# EAGLE design sesame-02 (EAGLE 5.11)
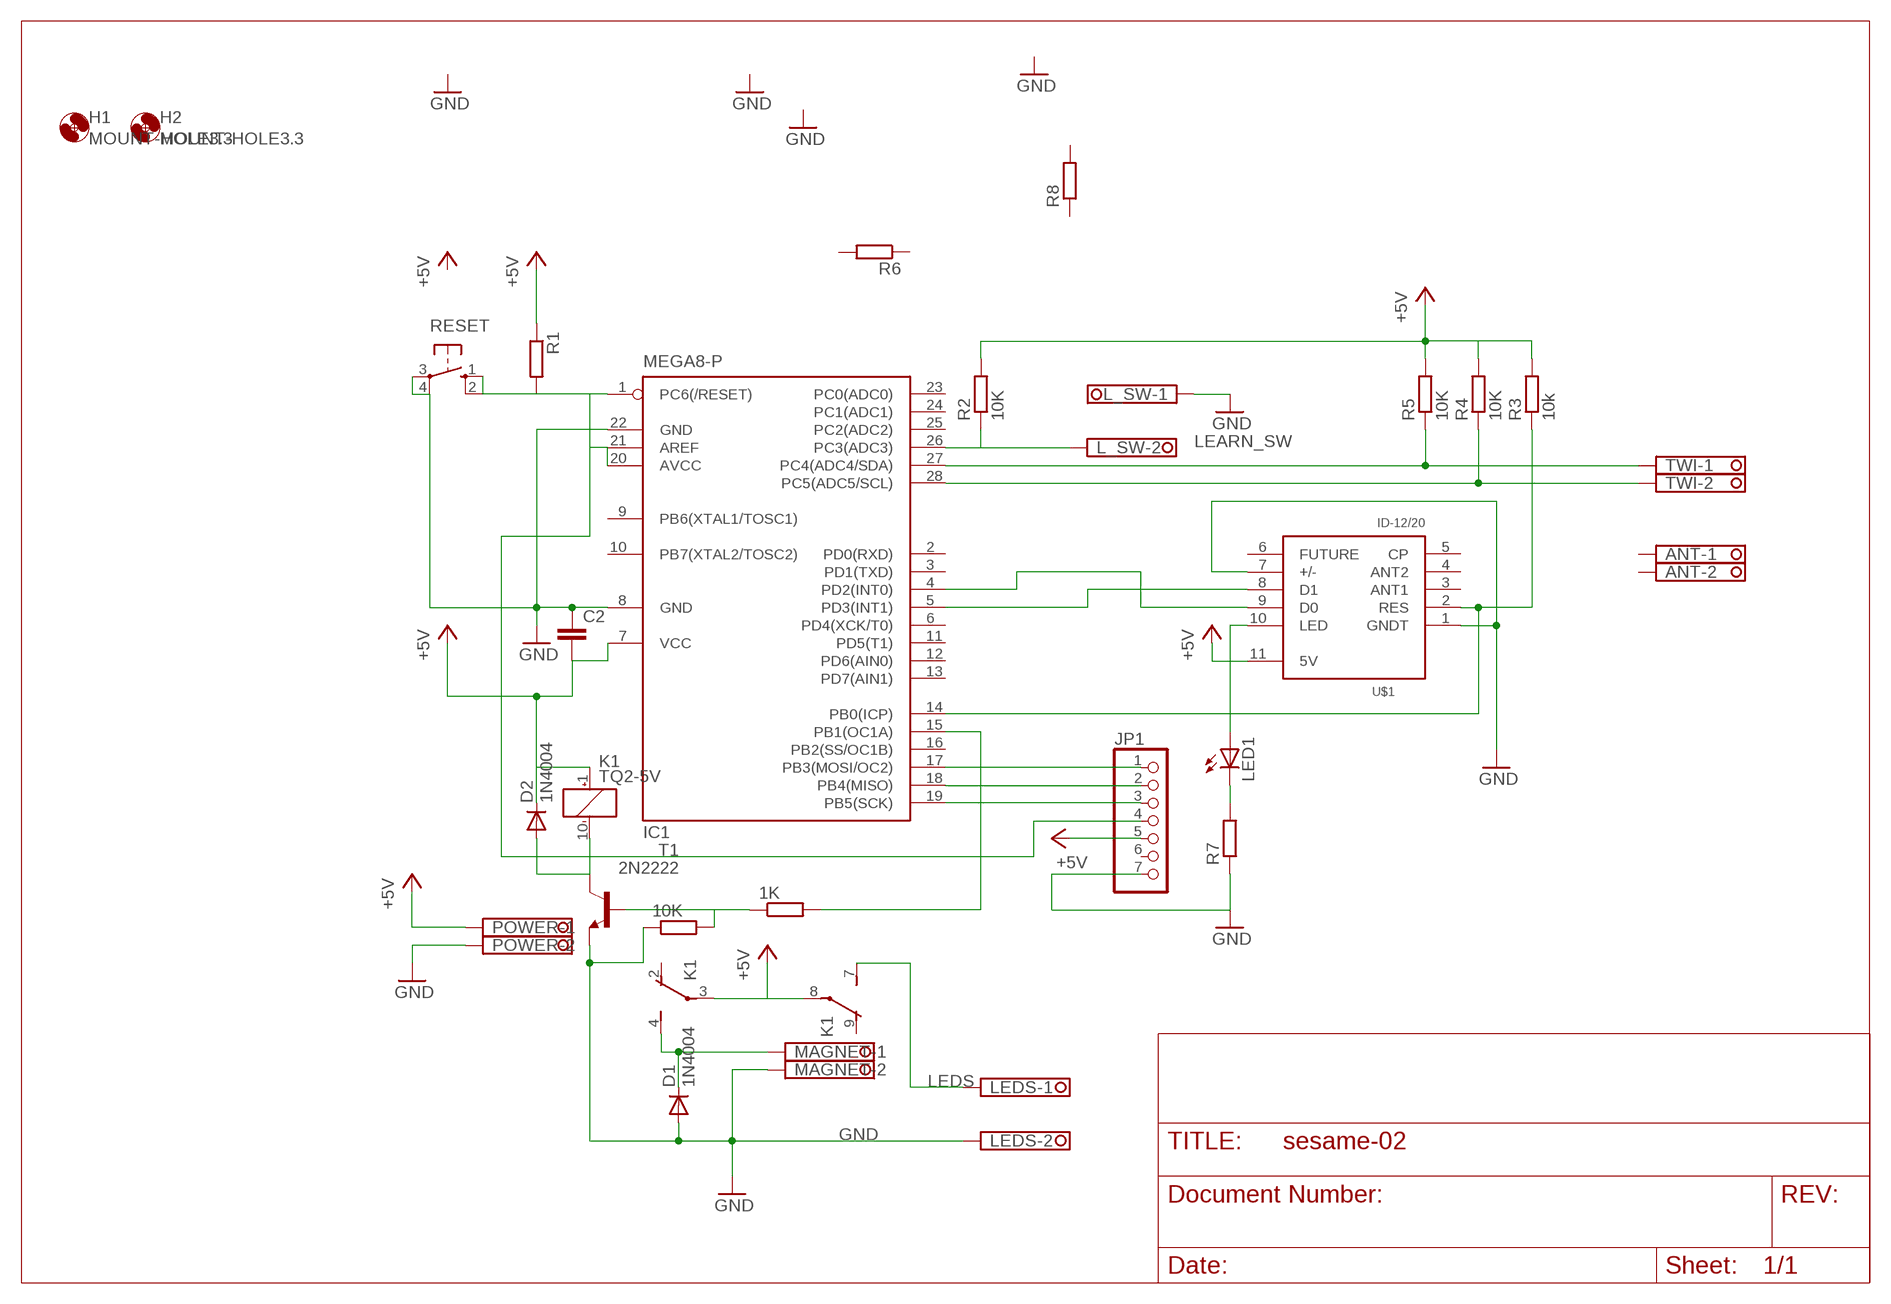
[diagram p0: schematic, sheet 1]

## Parts
1K  R-EU_0204/7  [0204/7]
10K  R-EU_0204/7  [0204/7]
ANT  1751248  [1751248]
C2  C-EU025-030X050  [C025-030X050]
D1  1N4004  [DO41-10]
D2  1N4004  [DO41-10]
H1  MOUNT-HOLE3.3  [3,3]
H2  MOUNT-HOLE3.3  [3,3]
IC1  MEGA8-P  [DIL28-3]
JP1  PINHD-1X7  [1X07]
K1  TQ2-5V  [TQ2]
L_SW  1751248  [1751248]
LED1  LED3MM  [LED3MM]
LEDS  1751248  [1751248]
MAGNET  1751248  [1751248]
POWER  1751248  [1751248]
R1  R-EU_0204/7  [0204/7]
R2  10K  R-EU_0204/5  [0204/5]
R3  10k  R-EU_0204/7  [0204/7]
R4  10K  R-EU_0204/7  [0204/7]
R5  10K  R-EU_0204/7  [0204/7]
R6  R-EU_0204/7  [0204/7]
R7  R-EU_0204/7  [0204/7]
R8  R-EU_0204/7  [0204/7]
RESET  10-XX  [B3F-10XX]
T1  2N2222  [TO18]
TWI  1751248  [1751248]
U$1  ID-12/20  [ID-12]

## Nets
+5V: C2.2 D2.C IC1.7(VCC) JP1.5 K1.3(1:P) K1.8(2:P) POWER.1 R1.1 R2.2 R3.2 R4.2 R5.2 U$1.11(5V)
GND: 10K.1 C2.1 D1.A IC1.8(GND) IC1.22(GND) JP1.7 L_SW.1 LEDS.2 MAGNET.2 POWER.2 R7.1 RESET.3(P) RESET.4(P1) T1.1(E) U$1.1(GNDT) U$1.7(+/-)
LEARN_SW: IC1.26(PC3(ADC3)) L_SW.2 R2.1
LEDS: K1.7(2:S) LEDS.1
N$1: IC1.5(PD3(INT1)) U$1.8(D1)
N$2: 1K.2 IC1.15(PB1(OC1A))
N$3: IC1.28(PC5(ADC5/SCL)) R4.1 TWI.2
N$4: IC1.27(PC4(ADC4/SDA)) R5.1 TWI.1
N$5: IC1.4(PD2(INT0)) U$1.9(D0)
N$7: IC1.19(PB5(SCK)) JP1.3
N$8: IC1.18(PB4(MISO)) JP1.2
N$9: IC1.17(PB3(MOSI/OC2)) JP1.1
N$10: D1.C K1.4(1:S) MAGNET.1
N$11: IC1.14(PB0(ICP)) R3.1 U$1.2(RES)
N$13: 1K.1 10K.2 T1.2(B)
N$18: IC1.1(PC6(/RESET)) IC1.20(AVCC) IC1.21(AREF) JP1.4 R1.2 RESET.1(S) RESET.2(S1)
N$21: LED1.A U$1.10(LED)
N$22: LED1.K(C) R7.2
N$23: D2.A K1.10(_:-) T1.3(C)
Unconnected: ANT.1 ANT.2 IC1.2(PD0(RXD)) IC1.3(PD1(TXD)) IC1.6(PD4(XCK/T0)) IC1.9(PB6(XTAL1/TOSC1)) IC1.10(PB7(XTAL2/TOSC2)) IC1.11(PD5(T1)) IC1.12(PD6(AIN0)) IC1.13(PD7(AIN1)) IC1.16(PB2(SS/OC1B)) IC1.23(PC0(ADC0)) IC1.24(PC1(ADC1)) IC1.25(PC2(ADC2)) JP1.6 K1.1(_:+) K1.2(1:O) K1.9(2:O) R6.1 R6.2 R8.1 R8.2 U$1.3(ANT1) U$1.4(ANT2) U$1.5(CP) U$1.6(FUTURE)

## Library data of the parts
1K 10K R1-R8 = rcl:R-EU_: RESISTOR, European symbol
ANT L_SW LEDS MAGNET POWER TWI = con-phoenix-350:1751248: MKDS 1/ 2-3,5 Printklemme Nennstrom: 10 A Bemessungsspannung: 160 V Raster: 3,5 mm Polzahl: 2 Montageart: Löten Anschlussart: Schraubanschluss Anschlussrichtung vom Leiter zur Platine: 0° Source: http://eshop.phoenixcontact.com .. 1751248.pdf
C2 = rcl:C-EU: CAPACITOR, European symbol
D1 D2 = diode:1N4004: DIODE general purpose rectifier, 1 A
H1 H2 = holes:MOUNT-HOLE: MOUNTING HOLE with drill center marker
IC1 = atmel:MEGA8-P: MICROCONTROLLER 8 Kbytes FLASH, 1 kbytes SRAM, 512 bytes EEPROM, USART, 4-channel 10 bit ADC, 2-channel 8 bit ADC Pin compatible with Atmega48, ATMega88, ATMega168 Source: avr.lbr
JP1 = pinhead:PINHD-1X7: PIN HEADER
K1 = relay:TQ2?*: LOW PROFILE 2 FORM C RELAY NAiS Source: http://www.mew-europe.com/.. en_ds_61020_0001.pdf Source: http://www.mew-europe.com/.. en_ds_61020_0004.pdf
LED1 = led:LED: LED OSRAM: - CHIPLED LG R971, LG N971, LY N971, LG Q971, LY Q971, LO R971, LY R971 LH N974, LH R974 LS Q976, LO Q976, LY Q976 LO Q996 - Hyper CHIPLED LW Q18S LB Q993, LB Q99A, LB R99A - SideLED LS A670, LO A670, LY A670, LG A670, LP A670 LB A673, LV A673, LT A673, LW A673 LH A674 LY A675 LS A676, LA A676, LO A676, LY A676, LW A676 LS A679, LY A679, LG A679 - Hyper Micro SIDELED® LS Y876, LA Y876, LO Y876, LY Y876 LT Y87S - SmartLED LW L88C, LW L88S LB L89C, LB L89S, LG L890 LS L89K, LO L89K, LY L89K LS L896, LA L896, LO L896, LY L896 - TOPLED LS T670, LO T670, LY T670, LG T670, LP T670 LSG T670, LSP T670, LSY T670, LOP T670, LYG T670 LG T671, LOG T671, LSG T671 LB T673, LV T673, LT T673, LW T673 LH T674 LS T676, LA T676, LO T676, LY T676, LB T676, LH T676, LSB T676, LW T676 LB T67C, LV T67C, LT T67C, LS T67K, LO T67K, LY T67K, LW E67C LS E67B, LA E67B, LO E67B, LY E67B, LB E67C, LV E67C, LT E67C LW T67C LS T679, LY T679, LG T679 LS T770, LO T770, LY T770, LG T770, LP T770 LB T773, LV T773, LT T773, LW T773 LH T774 LS E675, LA E675, LY E675, LS T675 LS T776, LA T776, LO T776, LY T776, LB T776 LHGB T686 LT T68C, LB T68C - Hyper Mini TOPLED® LB M676 - Mini TOPLED Santana® LG M470 LS M47K, LO M47K, LY M47K Source: http://www.osram.convergy.de LUXEON: - LUMILED® LXK2-PW12-R00, LXK2-PW12-S00, LXK2-PW14-U00, LXK2-PW14-V00 LXK2-PM12-R00, LXK2-PM12-S00, LXK2-PM14-U00 LXK2-PE12-Q00, LXK2-PE12-R00, LXK2-PE12-S00, LXK2-PE14-T00, LXK2-PE14-U00 LXK2-PB12-K00, LXK2-PB12-L00, LXK2-PB12-M00, LXK2-PB14-N00, LXK2-PB14-P00, LXK2-PB14-Q00 LXK2-PR12-L00, LXK2-PR12-M00, LXK2-PR14-Q00, LXK2-PR14-R00 LXK2-PD12-Q00, LXK2-PD12-R00, LXK2-PD12-S00 LXK2-PH12-R00, LXK2-PH12-S00 LXK2-PL12-P00, LXK2-PL12-Q00, LXK2-PL12-R00 Source: www.luxeon.com KINGBRIGHT: KA-3528ASYC Source: www.kingbright.com
RESET = switch-omron:10-XX: OMRON SWITCH
T1 = transistor:2N2222: NPN TRANSISTOR
U$1 = SparkFun:ID-12/20: ID2, ID12, and ID20 Package

## Board
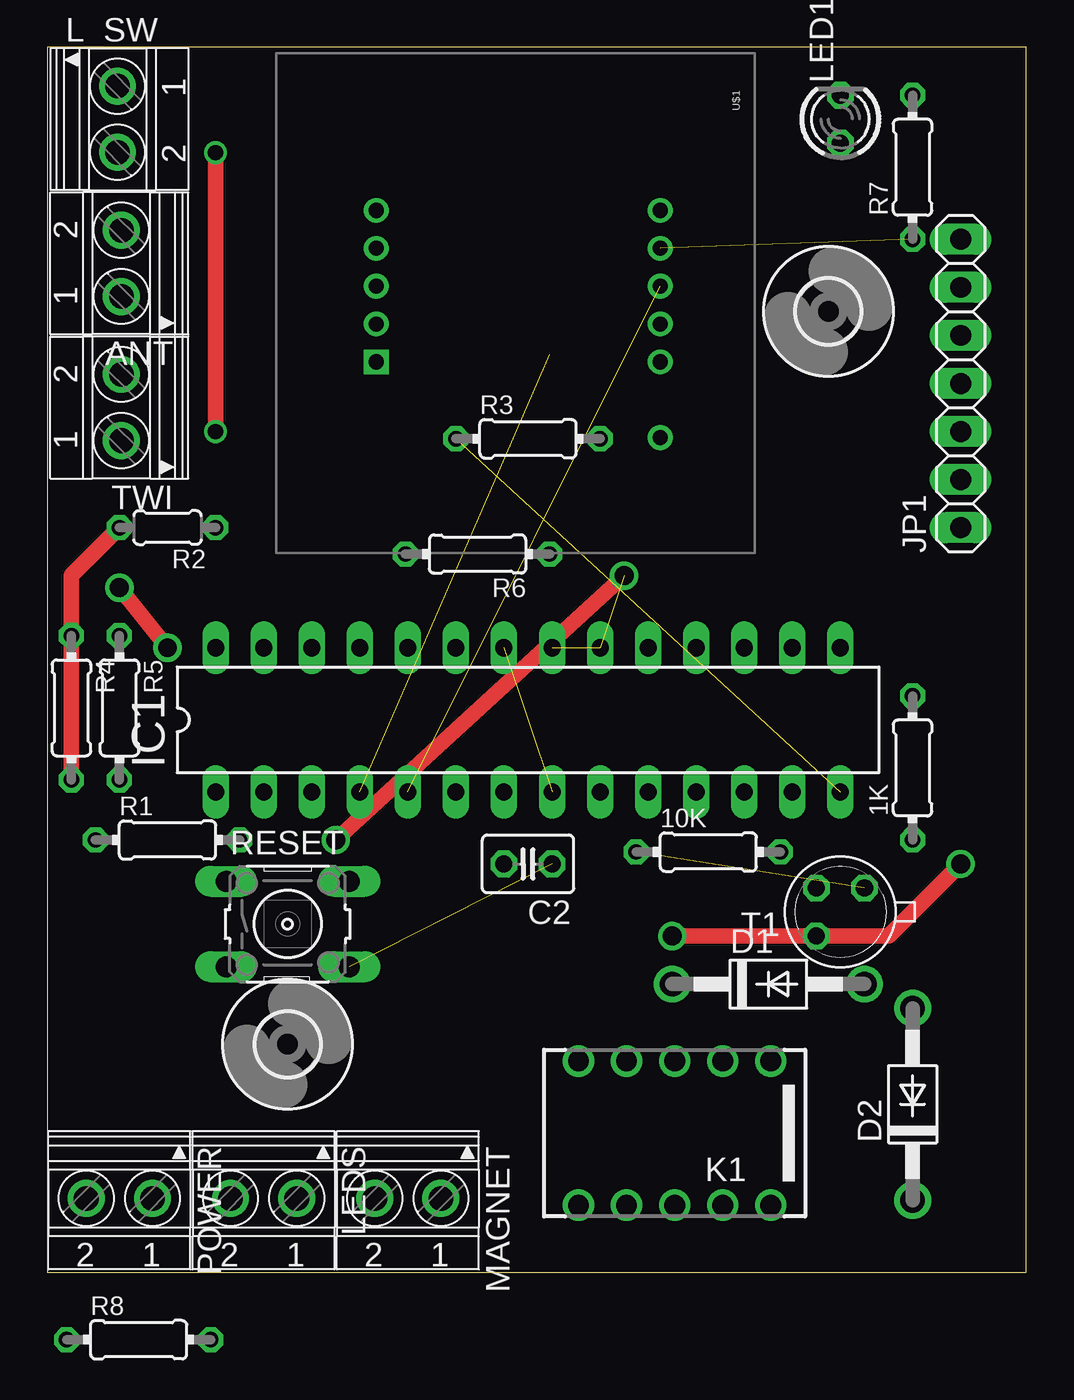
[diagram p1: board, top side]
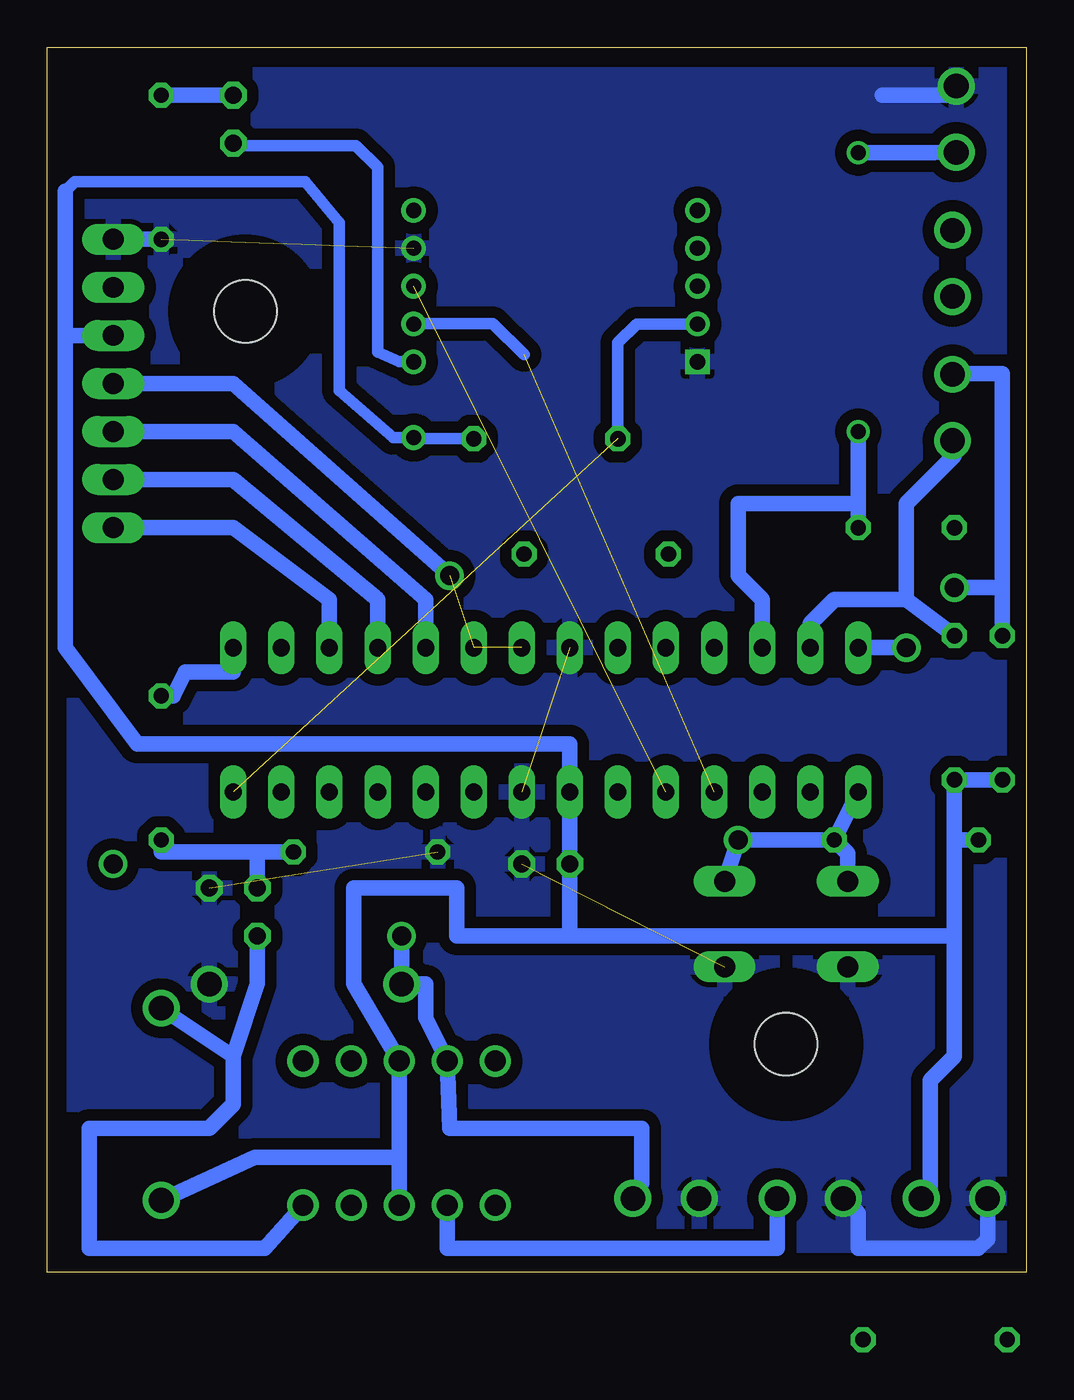
[diagram p2: board, bottom side, seen from below]

Size 51.74 x 64.76 mm. Coordinates in mm from the lower left corner, seen from the top.
Outline: 0,0 51.74,0 51.74,64.76 0,64.76 0,0
Copper layers (1*16): Top 0.035mm / dielectric 1.5mm / Bottom 0.035mm
Design rules "default *": minimum track width 10mil, minimum drill 24mil, track to track 24mil, track to pad 8mil, pad to pad 8mil, via to via 8mil, smd to smd 8mil, copper to edge 40mil, drill to drill 8mil, minimum pad ring 10mil, minimum via ring 8mil, stop-mask expansion 4mil, vias tented up to drill 0mil, thermal gap 10mil

### Footprints (pad centres in the part's own frame; a part is rotated, then mirrored left to right if it is on the bottom)
0204/7 = drill 0.813 octagon: 1 -3.81,0; 2 3.81,0
1751248 = drill 1.3 pad 1.7 round: 1 -1.75,-0.1; 2 1.75,-0.1
C025-030X050 = drill 0.9 octagon: 1 -1.27,0; 2 1.27,0
DO41-10 = drill 1.3 round: A 5.08,0; C -5.08,0
3,3 = hole 3.3: 0,0
DIL28-3 = drill 0.9 long: 1 -16.51,-3.81; 2 -13.97,-3.81; 3 -11.43,-3.81; 4 -8.89,-3.81; 5 -6.35,-3.81; 6 -3.81,-3.81; 7 -1.27,-3.81; 8 1.27,-3.81; 9 3.81,-3.81; 10 6.35,-3.81; 11 8.89,-3.81; 12 11.43,-3.81; 13 13.97,-3.81; 14 16.51,-3.81; 15 16.51,3.81; 16 13.97,3.81; 17 11.43,3.81; 18 8.89,3.81; 19 6.35,3.81; 20 3.81,3.81; 21 1.27,3.81; 22 -1.27,3.81; 23 -3.81,3.81; 24 -6.35,3.81; 25 -8.89,3.81; 26 -11.43,3.81; 27 -13.97,3.81; 28 -16.51,3.81
1X07 = drill 1.1 long: 1 -7.62,0; 2 -5.08,0; 3 -2.54,0; 4 0,0; 5 2.54,0; 6 5.08,0; 7 7.62,0
TQ2 = drill 1.1 round: 1 -5.08,-3.81; 2 -2.54,-3.81; 3 0,-3.81; 4 2.54,-3.81; 5 5.08,-3.81; 6 5.08,3.81; 7 2.54,3.81; 8 0,3.81; 9 -2.54,3.81; 10 -5.08,3.81
LED3MM = drill 0.9 octagon: A -1.27,0; K 1.27,0
0204/5 = drill 0.813 octagon: 1 -2.54,0; 2 2.54,0
B3F-10XX = drill 1.1 long: 1 -3.251,2.261; 2 3.251,2.261; 3 -3.251,-2.261; 4 3.251,-2.261
TO18 = drill 0.9 octagon: 1 -1.27,-1.27; 2 1.27,-1.27; 3 1.27,1.27
ID-12 = drill 0.8 square: 1 16.255,5.32 | drill 0.8 round: 2 14.255,5.32; 3 12.255,5.32; 4 10.255,5.32; 5 8.255,5.32; 6 8.255,20.32; 7 10.255,20.32; 8 12.255,20.32; 9 14.255,20.32; 10 16.255,20.32; 11 20.255,20.32

### Placement (x,y rotation side)
1K  45.72,26.67 90 top
10K  34.92,22.23 0 top
ANT  3.81,53.34 90 top
C2  25.4,21.59 180 top
D1  38.1,15.24 0 top
D2  45.72,8.89 90 top
H1  41.27,50.8 0 top
H2  12.7,12.06 0 top
IC1  25.4,29.21 0 top
JP1  48.26,46.99 90 top
K1  33.15,7.37 180 top
L_SW  3.81,60.96 270 top
LED1  41.91,60.96 90 top
LEDS  11.43,3.81 180 top
MAGNET  19.05,3.81 180 top
POWER  3.81,3.81 180 top
R1  6.35,22.86 0 top
R2  6.35,39.37 180 top
R3  25.4,44.07 0 top
R4  1.27,29.84 270 top
R5  3.81,29.84 270 top
R6  22.73,37.97 180 top
R7  45.72,58.42 90 top
R8  4.83,-3.56 0 top  (outside the outline)
RESET  12.7,18.41 0 top
T1  41.91,19.05 180 top
TWI  3.81,45.72 90 top
U$1  12.06,64.39 270 top

### Tracks (layer width: path | path; a pad name or v marks a point on that pad's centre or on a via)
+5V
  Top 0.813: R2.2 1.27,36.83 R4.2
  Bottom 0.61: 50.8,57.15 50.29,57.66 38.1,57.66 36.32,55.5 36.32,46.61 33.47,44.13 U$1.11 32.32,44.07 R3.2
  Bottom 0.813: 50.8,49.53 50.8,33.02 46.99,27.94 24.13,27.94 IC1.7 C2.2 24.13,17.78 | 50.8,49.53 50.8,57.15 | 33.15,6.1 K1.3 35.56,15.24 35.56,20.32 30.1,20.32 30.1,17.78 24.13,17.78 | R4.2 R5.2 3.81,22.86 | 33.15,6.1 K1.8 | 33.15,6.1 40.77,6.1 D2.C | 3.81,22.86 R1.1 | 3.81,17.78 3.81,11.43 5.08,10.16 5.08,4.39 POWER.1 | 3.81,17.78 3.81,22.86 | 3.81,17.78 24.13,17.78 | 50.8,49.53 JP1.5
GND  (4 unrouted)
  Bottom 0.813: POWER.2 2.06,1.75 2.54,1.27 8.89,1.27 8.89,3.12 LEDS.2 | R7.1 JP1.7 | 7.62,62.23 4.19,62.23 L_SW.1
  pour Bottom: 1.27,63.5 1.27,1.27 50.8,1.27 50.8,63.5
LEARN_SW  (via drill 0.8)
  Top 0.813: v8.89,44.45 v8.89,59.18
  Bottom 0.813: IC1.26 13.97,35.56 15.24,36.83 15.24,40.64 8.89,40.64 | R2.1 8.89,40.64 | 8.89,40.64 v8.89,44.45 | v8.89,59.18 4.88,59.18 L_SW.2
LEDS
  Bottom 0.813: K1.7 30.61,1.27 13.18,1.27 LEDS.1
N$1  (1 unrouted)
N$2
  Bottom 0.813: 1K.2 45.09,30.48 44.45,31.75 41.91,31.75 IC1.15
N$3  (via drill 1)
  Top 0.813: v3.81,36.2 v6.35,33.02
  Bottom 0.813: R4.1 1.27,36.2 | v6.35,33.02 IC1.28 | 1.27,36.2 v3.81,36.2 | 1.27,36.2 1.27,47.5 3.43,47.5 TWI.2
N$4
  Bottom 0.813: 6.35,35.56 6.35,40.64 3.81,43.18 3.81,43.23 TWI.1 | R5.1 6.35,35.56 | 6.35,35.56 10.16,35.56 11.43,34.29 IC1.27
N$5  (1 unrouted)
  Bottom 0.61: 26.54,48.51 28.19,50.16 32.35,50.16 U$1.9
N$7
  Bottom 0.813: IC1.19 31.75,35.56 41.91,44.45 JP1.3
N$8
  Bottom 0.813: IC1.18 34.29,35.56 41.91,41.91 JP1.2
N$9
  Bottom 0.813: IC1.17 36.83,35.56 41.91,39.37 JP1.1
N$10  (via drill 1)
  Top 0.813: v33.02,17.78 44.45,17.78 v48.26,21.59
  Bottom 0.813: v33.02,17.78 D1.C 31.75,15.24 31.75,13.46 K1.4 30.48,7.62 20.32,7.62 20.32,4.7 MAGNET.1
N$11  (1 unrouted)
  Bottom 0.61: U$1.2 20.61,50.13 21.59,49.15 R3.1
N$13
  Bottom 0.813: 40.64,22.23 T1.2 | 40.64,22.23 45.72,22.23 1K.1 | 10K.2 40.64,22.23
N$18  (via drill 1)  (2 unrouted)
  Top 0.813: v15.24,22.86 v30.48,36.83
  Bottom 0.813: R1.2 IC1.1 | v30.48,36.83 41.91,46.99 JP1.4 | RESET.2 v15.24,22.86 R1.2 | RESET.1 9.45,22.15 R1.2
N$21
  Bottom 0.61: U$1.10 33.15,48.13 34.29,48.64 34.29,58.42 35.43,59.56 41.78,59.56 LED1.A
N$22
  Bottom 0.813: LED1.K R7.2
N$23
  Bottom 0.813: K1.10 40.26,1.27 49.53,1.27 49.53,7.62 43.18,7.62 41.91,8.89 41.91,11.43 | 41.91,11.43 40.64,15.24 T1.3 | 41.91,11.43 D2.A

### Text on the board
Document: ANT